# Altium schematic sheet KV_Vision.SchDoc
size A3; PageSetup: Record=PageOptions|CenterHorizontal=True|CenterVertical=True|PrintScale=1.00|XCorrection=1.00|YCorrection=1.00|PrintKind=2|BorderSize=5000000|LeftOffset=0|BottomOffset=0|Orientation=2|PaperLength=1000|PaperWidth=1000|Scale=100|PaperSource=7|PrintQuality=-4|MediaType=1|DitherType=10|PaperKind=A3|PrintScaleMode=1
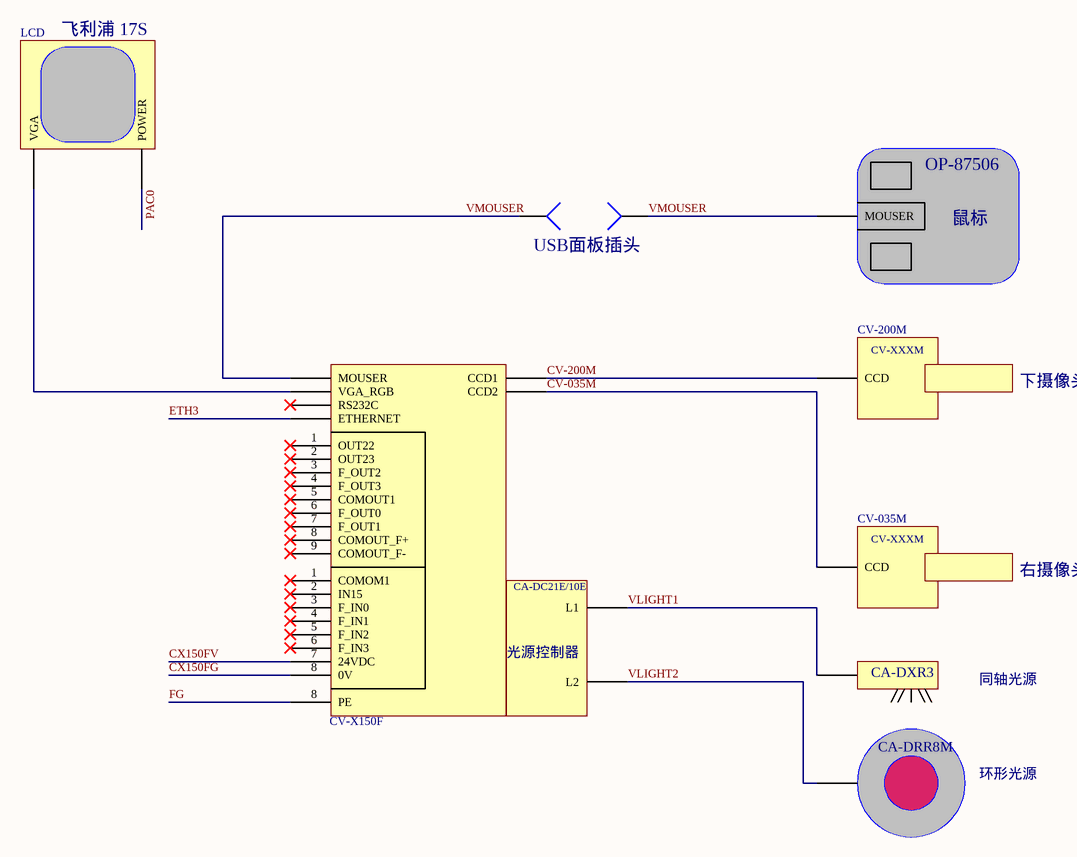
[diagram p0: KV_Vision.SchDoc]

## Parts
(Parts that share a designator on the sheet are numbered #1, #2 ... from top to bottom, then left to right.)
*#1  LCD
*#2  MOUSER  (value not drawn)
*#3  CV-200M
*#4  CV-X150F
*#5  CV-035M
*#6  CA-DC21E/10E  (value not drawn)
*#7  CA-DXR3  (value not drawn)
*#8  CA-DRR8M  (value not drawn)
J?#1  Socket  [PIN1]  (value not drawn)
J?#2  Socket  [PIN1]  (value not drawn)

## Nets
CV-035M: *#4.11(CCD2) *#5.0(CCD)
CV-200M: *#3.0(CCD) *#4.10(CCD1)
CX150FG: *#4.8(COMOUT_F+)
CX150FV: *#4.7(F_OUT1)
ETH3: *#4.?3(ETHERNET)
FG: *#4.8(PE)
PAC0: *#1.1(POWER)
VLIGHT1: *#6.0(L1) *#7.0
VLIGHT2: *#6.1(L2) *#8.0
VMOUSER: *#2.0(MOUSER) *#4.?4(MOUSER) J?#1.1 J?#2.1
Net*#1_0: *#1.0(VGA) *#4.?1(VGA_RGB)

Not connected (* = marked no-connect by the designer): *#4 1(OUT22)* 2(OUT23)* 3(F_OUT2)* 4(F_OUT3)* 5(COMOUT1)* 6(F_OUT0)* 9(COMOUT_F-)* ?2(RS232C)*

## Notes on the sheet
- 飞利浦 17S
- OP-87506
- (near J?#2) USB面板插头
- 鼠标
- 下摄像头
- 右摄像头
- (near *#4) 光源控制器
- 同轴光源
- 环形光源
- (in symbol CV-200M) CV-XXXM

## Library data of the parts
*#5 = CV-200M
J?#1 J?#2 = Socket: LatestRevisionDate: 17-Jul-2002; LatestRevisionNote: Re-released for DXP Platform.; Publisher: Altium Limited